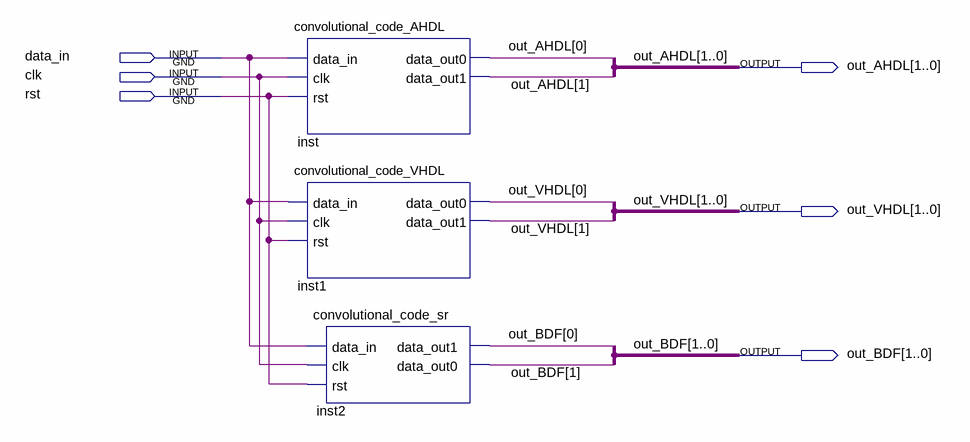
[diagram p0: schematic sheet]
// Quartus schematic conv_code_comparison.bdf as structural Verilog: 3 symbols, 6 pins
module conv_code_comparison (
  input  data_in,
  input  clk,
  input  rst,
  output [1:0] out_AHDL,
  output [1:0] out_VHDL,
  output [1:0] out_BDF
);

  convolutional_code_AHDL inst (
    .data_in(data_in), .clk(clk), .rst(rst), .data_out0(out_AHDL[0]), .data_out1(out_AHDL[1]));
  convolutional_code_VHDL inst1 (
    .data_in(data_in), .clk(clk), .rst(rst), .data_out0(out_VHDL[0]), .data_out1(out_VHDL[1]));
  convolutional_code_sr inst2 (.data_in(data_in), .clk(clk), .rst(rst), .data_out1(out_BDF[0]), .data_out0(out_BDF[1]));
endmodule
